# Altium schematic sheet RS485.SchDoc
size A; SheetNumber: 2; SheetTotal: 3
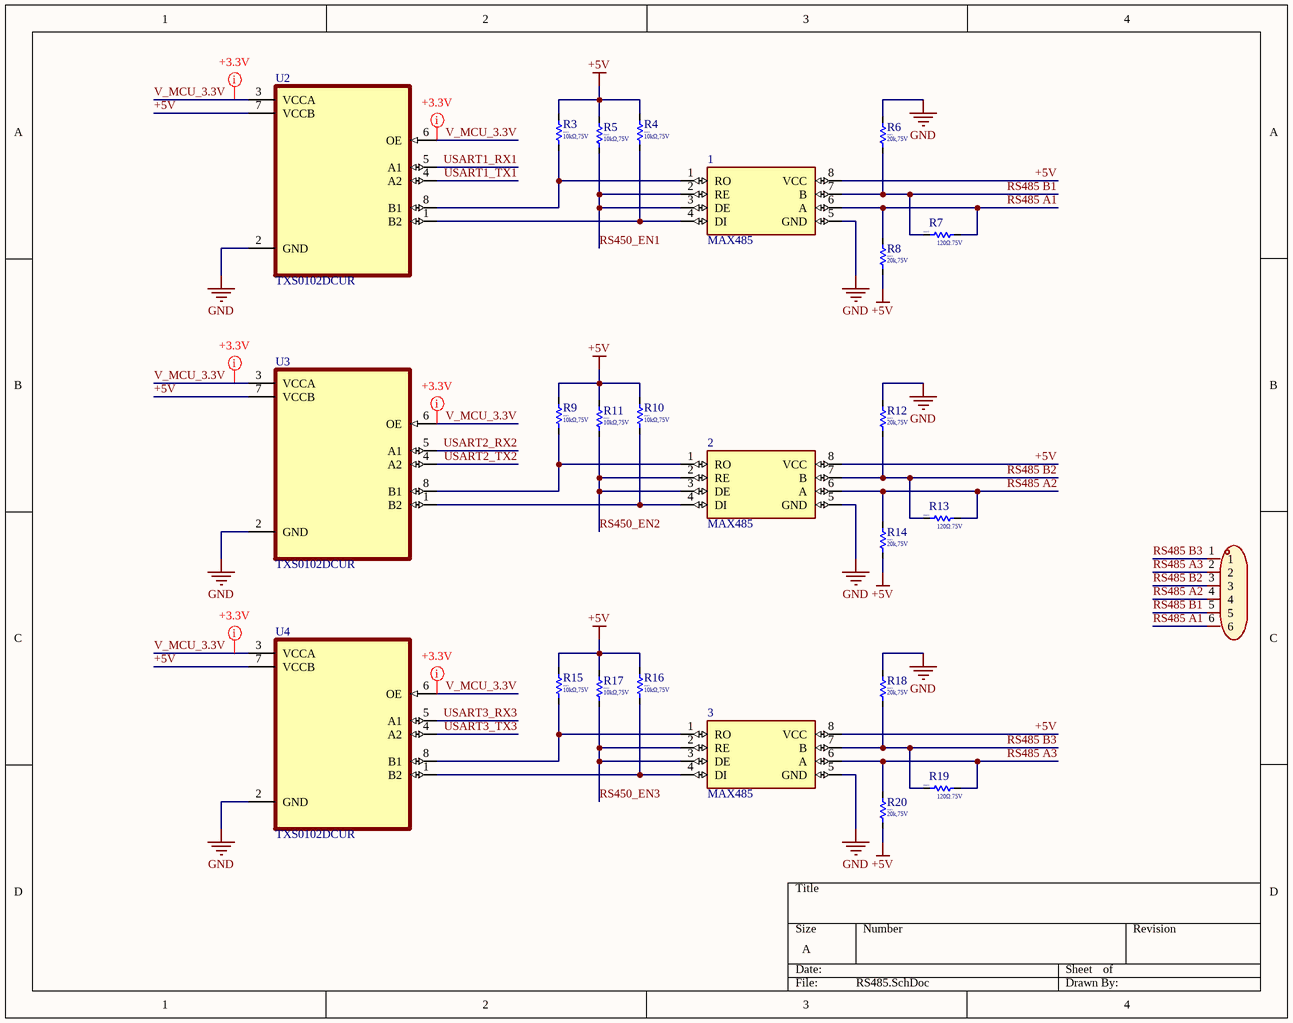
[diagram p0: RS485.SchDoc]

## Parts
1  MAX485  [MAX485]
2  MAX485  [MAX485]
3  MAX485  [MAX485]
CN1  DB128V-5.08-6P-GN-S  [6P_P=5.08mm]  (value not drawn)
R3  value 10kΩ,75V  Package: 0603  [R0603]  (hidden comment: 0603WAF100JT5E)
R4  value 10kΩ,75V  Package: 0603  [R0603]  (hidden comment: 0603WAF100JT5E)
R5  value 10kΩ,75V  Package: 0603  [R0603]  (hidden comment: 0603WAF100JT5E)
R6  value 20k,75V  Package: 0603  [R0603]  (hidden comment: 20k)
R7  value 120Ω.75V  Package: 0603  [R0603]  (hidden comment: 120R)
R8  value 20k,75V  Package: 0603  [R0603]  (hidden comment: 20k)
R9  value 10kΩ,75V  Package: 0603  [R0603]  (hidden comment: 0603WAF100JT5E)
R10  value 10kΩ,75V  Package: 0603  [R0603]  (hidden comment: 0603WAF100JT5E)
R11  value 10kΩ,75V  Package: 0603  [R0603]  (hidden comment: 0603WAF100JT5E)
R12  value 20k,75V  Package: 0603  [R0603]  (hidden comment: 20k)
R13  value 120Ω.75V  Package: 0603  [R0603]  (hidden comment: 120R)
R14  value 20k,75V  Package: 0603  [R0603]  (hidden comment: 20k)
R15  value 10kΩ,75V  Package: 0603  [R0603]  (hidden comment: 0603WAF100JT5E)
R16  value 10kΩ,75V  Package: 0603  [R0603]  (hidden comment: 0603WAF100JT5E)
R17  value 10kΩ,75V  Package: 0603  [R0603]  (hidden comment: 0603WAF100JT5E)
R18  value 20k,75V  Package: 0603  [R0603]  (hidden comment: 20k)
R19  value 120Ω.75V  Package: 0603  [R0603]  (hidden comment: 120R)
R20  value 20k,75V  Package: 0603  [R0603]  (hidden comment: 20k)
U2  TXS0102DCUR  [8-VSSOP]
U3  TXS0102DCUR  [8-VSSOP]
U4  TXS0102DCUR  [8-VSSOP]

## Nets
+5V: 1.8(VCC) 2.8(VCC) 3.8(VCC) R3.2 R4.2 R5.2 R8.1 R9.2 R10.2 R11.2 R14.1 R15.2 R16.2 R17.2 R20.1 U2.7(VCCB) U3.7(VCCB) U4.7(VCCB)
GND: 1.5(GND) 2.5(GND) 3.5(GND) R6.2 R12.2 R18.2 U2.2(GND) U3.2(GND) U4.2(GND)
RS450_EN1: 1.2(RE) 1.3(DE) R5.1
RS450_EN2: 2.2(RE) 2.3(DE) R11.1
RS450_EN3: 3.2(RE) 3.3(DE) R17.1
RS485 A1: 1.6(A) CN1.6 R7.2 R8.2
RS485 A2: 2.6(A) CN1.4 R13.2 R14.2
RS485 A3: 3.6(A) CN1.2 R19.2 R20.2
RS485 B1: 1.7(B) CN1.5 R6.1 R7.1
RS485 B2: 2.7(B) CN1.3 R12.1 R13.1
RS485 B3: 3.7(B) CN1.1 R18.1 R19.1
USART1_RX1: U2.5(A1)
USART1_TX1: U2.4(A2)
USART2_RX2: U3.5(A1)
USART2_TX2: U3.4(A2)
USART3_RX3: U4.5(A1)
USART3_TX3: U4.4(A2)
V_MCU_3.3V: U2.3(VCCA) U2.6(OE) U3.3(VCCA) U3.6(OE) U4.3(VCCA) U4.6(OE)
Net1_1: 1.1(RO) R3.1 U2.8(B1)
Net1_4: 1.4(DI) R4.1 U2.1(B2)
Net2_1: 2.1(RO) R9.1 U3.8(B1)
Net2_4: 2.4(DI) R10.1 U3.1(B2)
Net3_1: 3.1(RO) R15.1 U4.8(B1)
Net3_4: 3.4(DI) R16.1 U4.1(B2)

## Layout directives
net class +3.3V: V_MCU_3.3V

## Library data of the parts
1-3 = MAX485: 1/1 Transceiver Half RS422, RS485 8-SOIC; Manufacturer: Maxim Integrated; Package: SOIC-8 Maxim Integrated; Value: *; MPN: MAX485
CN1 = DB128V-5.08-6P-GN-S: 1x6P 20A -40℃~+105℃ 300V Green 12~30 Direct Insert 5.08mm 2.5 1 6 Plugin,P=5.08mm Screw Terminal; Manufacturer: DORABO; LCSC: C2915642; MPN: DB128V-5.08-6P-GN-S; Package: 插件,P=5.08mm; Datasheet: https://atta.szlcsc.com/upload/public/pdf/source/20230106/CC449C10514519CDCE20F1C37DBF2DAC.pdf; Operating Temperature Range: -40℃~+105℃
R3-R5 R9-R11 R15-R17 = 0603WAF100JT5E: 100mW Thick Film Resistors ±1% ±400ppm/℃ 10Ω 0603 Chip Resistor - Surface Mount ROHS; Manufacturer: UNI-ROYAL(Uniroyal Elec); MPN: 0603WAF1002T5E; Datasheet: https://datasheet.lcsc.com/szlcsc/Uniroyal-Elec-0603WAF1002T5E_C25804.pdf; LCSC: C25804
R6 R8 R12 R14 R18 R20 = 0603WAF2002T5E: 100mW Thick Film Resistors ±100ppm/℃ ±1% 20kΩ 0603 Chip Resistor - Surface Mount ROHS; Manufacturer: UNI-ROYAL(Uniroyal Elec); MPN: 0603WAF1002T5E; Datasheet: https://datasheet.lcsc.com/szlcsc/Uniroyal-Elec-0603WAF1002T5E_C25804.pdf; LCSC: C4184
R7 R13 R19 = 0603WAF1200T5E: 100mW Thick Film Resistors 75V ±100ppm/℃ ±1% 120Ω 0603 Chip Resistor - Surface Mount ROHS; Manufacturer: UNI-ROYAL(Uniroyal Elec); MPN: 0603WAF1002T5E; Datasheet: https://datasheet.lcsc.com/szlcsc/Uniroyal-Elec-0603WAF1002T5E_C25804.pdf; LCSC: C22787
U2-U4 = TXS0102DCUR: 2-Bit Bidirectional Voltage-Level Shifter for Open-Drain and Push-Pull Application 8-VSSOP -40 to 85; Manufacturer: Texas Instruments; Value: 2 Channel 24Mbps; MPN: TXS0102DCUR; Datasheet: https://www.ti.com/general/docs/suppproductinfo.tsp?distId=10&gotoUrl=https%3A%2F%2Fwww.ti.com%2Flit%2Fgpn%2Ftxs0102; LCSC: C53434; Package: VSSOP-8 Texas Instruments